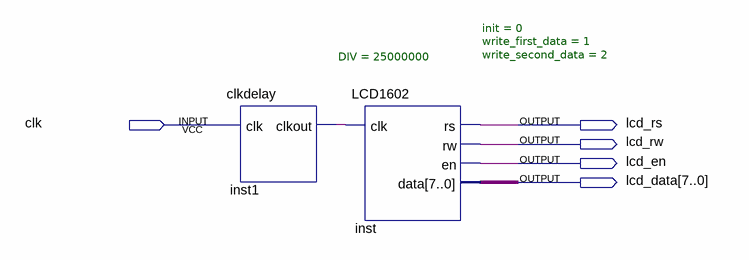
[diagram p0: schematic sheet]
// Quartus schematic LCD_test.bdf as structural Verilog: 2 symbols, 5 pins
module LCD_test (
  input  clk,
  output lcd_rs,
  output lcd_rw,
  output lcd_en,
  output [7:0] lcd_data
);

  wire inst1_clkout;

  clkdelay #(.DIV(25000000)) inst1 (.clk(clk), .clkout(inst1_clkout));
  LCD1602 #(.init(0), .write_first_data(1), .write_second_data(2)) inst (
    .clk(inst1_clkout), .rs(lcd_rs), .rw(lcd_rw), .en(lcd_en), .data(lcd_data));
endmodule
